# Altium project CATPIR.PrjPcb
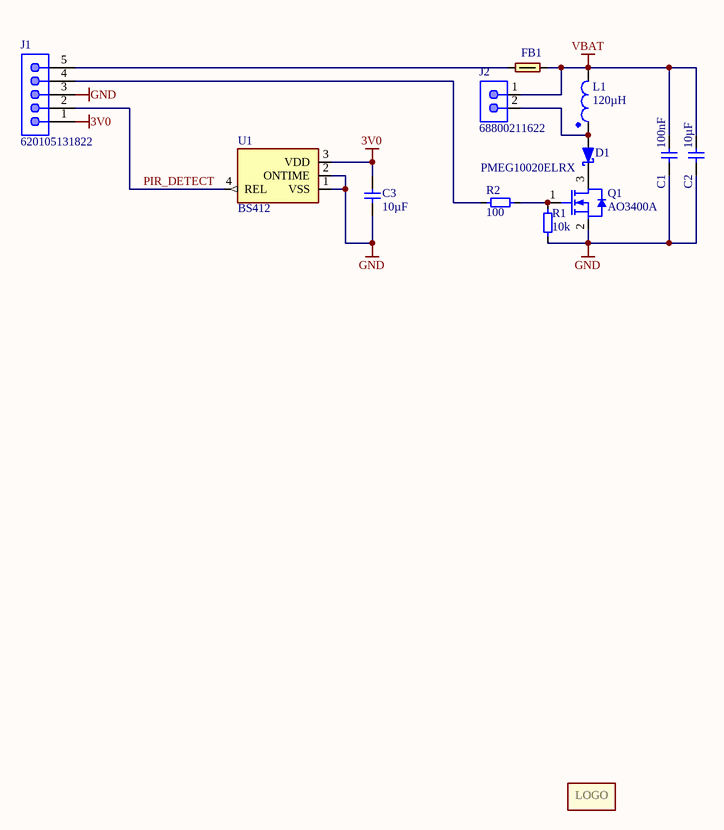
[diagram p0: pir-piezo.SchDoc]
assembly_revision: 0; board_name: CATPIR; board_revision: 1.0; Project_link: https://github.com/lieBtrau/cat-repeller
1 sheet, 13 parts. Net scope: global (net labels, ports and power ports of the same name join across sheets).
Board file: CATPIR.PcbDoc

## Sheet pir-piezo.SchDoc: PIR-sensor & Piezo speaker
size A4; Engineer: CT; SheetNumber: 1; SheetTotal: 1

### Parts
C1  value 100nF  [0603-C-N]  (hidden comment: Capacitor 100nF +/-10% 25V X7R 0603)
C2  value 10µF  [1206-C-N]  (hidden comment: Capacitor 10µF +/-10% 10V X7R 1206)
C3  value 10µF  [1206-C-N]  (hidden comment: Capacitor 10µF +/-10% 10V X7R 1206)
D1  PMEG10020ELRX  [FP-SOD123W-MFG]
FB1  742792625  [0603-L-N]  (value not drawn)
J1  620105131822  [620105131822]
J2  68800211622  [68800211622]
L1  Inductance: 120µH  [CL_STD6060]  (hidden comment: 74404064121)
M1  Logo  [LOGO_9x6mm]  (value not drawn)  (no BOM)
Q1  AO3400A  [SOT-23-3-N]
R1  value 10k  [0603-R-N]  (hidden comment: Resistor 10k +/-1% 50V 0603)
R2  value 100  [0603-R-N]  (hidden comment: Resistor 100R +/-1% 50V 0603)
U1  BS412  [BS412-Footprint-1]

### Nets
3V0: C3.1 J1.1 U1.3(VDD)
GND: C1.2 C2.1 C3.2 J1.3 Q1.2(S) R1.2 U1.1(VSS) U1.2(ONTIME)
VBAT: C1.1 C2.2 FB1.2 J2.1 L1.2
PIR_DETECT: J1.2 U1.4(REL)
NetD1_1: D1.1(K) Q1.3(D)
NetD1_2: D1.2(A) J2.2 L1.1
NetFB1_1: FB1.1 J1.5
NetJ1_4: J1.4 R2.1
NetQ1_1: Q1.1(G) R1.1 R2.2

### Notes on the sheet
- Title
- Sheet Revision:
- Link:
- Size:
- Project:
- Engineer:
- A4
- Date:
- Sheet
- of
- File:
- (in symbol Logo) LOGO

### Library data of the parts
C1 = CMP-072-000592-15: WCAP-CSGP Multilayer Ceramic Chip Capacitor, General Purpose, size 0603, X7R, 100nF, 25VDC; FLIR Part #: YCAM100N-5; Capacitor Type: MLCC; Dissipation Factor: 3.5%; Insulation Resistance: 5GO; Technical Reference: X7R0603104K025DFCT10000; Tolerance: 10%; Case/Package: 0603; ComponentLink1Description: Website Link; ComponentLink1URL: https://www.we-online.com/redexpert/article/885012206071?ad; ComponentLink2Description: Datasheet Link; ComponentLink2URL: https://www.we-online.com/redexpert/spec/885012206071?ad; Design Item ID: 885012206071; Dielectric: X7R; Height: 0.8mm; JLCPCB Part #: C14663; Length: 1.6mm; Match Code: WCAP-CSGP; Max Operating Temperature: 125°C; Min Operating Temperature: -55°C; Mounting Technology: SMT; Packaging: Tape and Reel; Pins: 2; Source: WCAP-CSGP.SchLib; Usage: General Purpose; Voltage Rating: 25V; Width: 0.8mm
C2 C3 = CMP-072-000777-16: WCAP-CSGP Multilayer Ceramic Chip Capacitor, General Purpose, size 1206, X7R, 10µF, 10VDC; FLIR Part #: YCAM10U-9; Capacitor Type: MLCC; Technical Reference: X7R1206106K010DFCT10000; Tolerance: 10%; Insulation Resistance: 0.01GO; JLCPCB Part #: C70462; ComponentLink2Description: Datasheet Link; Voltage Rating: 10V; ComponentLink1URL: https://www.we-online.com/redexpert/article/885012208018?ad; ComponentLink2URL: https://www.we-online.com/redexpert/spec/885012208018?ad; Width: 1.6mm; Length: 3.2mm; Mounting Technology: SMT; Max Operating Temperature: 125°C; Case/Package: 1206; ComponentLink1Description: Website Link; Match Code: WCAP-CSGP; Height: 1.6mm; Design Item ID: 885012208018; Min Operating Temperature: -55°C; Usage: General Purpose; Dissipation Factor: 10%; Dielectric: X7R; Pins: 2; Packaging: Tape and Reel; Source: WCAP-CSGP.SchLib
D1 = CMP-004-00046-6: Diode Schottky 100V 2A 2-Pin SOD-123F T/R; Forward Voltage: 830 mV @ 2 A; Case/Package: SOD-123F; Packaging: Tape and Reel; Max Reverse Voltage (DC): 100V; Mounting Technology: Surface Mount; JLCPCB Part #: C456130; RoHS Compliant: Yes; Average Rectified Current: 2A; Series: -; Forward Current: 2A
FB1 = CMP-066-000112-5: WE-CBF SMT EMI Suppression Ferrite Bead, size 0603, 120O, 2A; Manufacturer: Wurth Elektronik; FLIR Part #: YCOLFB100E-1; Type: High Current; Impedance Max Test Condition: 400MHz; Case/Size Code: 0603; Impedance Max: 180O; DC Resistance Max: 0.05O; Length: 1.6mm; Impedance @100MHz: 120O; Design Item ID: 742792625; Rated Current: 2A; ComponentLink2Description: Datasheet Link; Width: 0.8mm; ComponentLink1URL: https://www.we-online.com/redexpert/article/742792625?ad; Component Type: Standard; Height: 0.8mm; JLCPCB Part #: C114770; Source: WE-CBF.SchLib; Operating Temperature Min: -55°C; Category: Ferrites for PCB Assembly; Operating Temperature Max: 125°C; Mount: Surface Mount; Packaging: Tape and Reel; ComponentLink1Description: Website Link; ComponentLink2URL: https://www.we-online.com/redexpert/spec/742792625?ad; Manufacturer Part Number: 742792625; Match Code: WE-CBF; Pin Count: 2
J1 = CMP-047-000043-5: WR-WTB SMT Male Horizontal Shrouded Header, pitch 2mm, 5p; Contact Resistance: 20mOhm; Rated Current: 2A; Pin Number: 5; Working Voltage: 100VAC; Withstanding Voltage: 800VAC; Mounting Technology: SMT; Component Type: Standard; ComponentLink1URL: http://www.we-online.de; ComponentLink2URL: https://www.we-online.com/catalog/datasheet/620105131822.pdf; Published Date: January 2020; Pin Count: 5; ComponentLink1Description: Manufacturer; Design Item ID: 620105131822; Packaging: Tape and Reel; Source: WR-WTB_2.00mm.SchLib; Gender: Male; Publisher: Wurth Elektronik; Part Number: 620105131822; ComponentLink2Description: Datasheet; Pitch: 2mm; Operating Temperature: -25 to +85degC; Type: Horizontal; JLCPCB Part #: C265104
J2 = CMP-047-000210-5: WR-WTB “J” Type THT Vertical Male Shrouded Header, pitch 2.5mm, 2p; Working Voltage: 250VAC; Withstanding Voltage: 800VAC; Contact Resistance: 20mOhm; Pin Number: 2; Rated Current: 3A; JLCPCB Part #: C160262; ComponentLink2URL: https://www.we-online.com/catalog/datasheet/68800211622.pdf; Published Date: January 2020; Pin Count: 2; Pitch: 2.5mm; ComponentLink1Description: Manufacturer; Type: Vertical; Design Item ID: 68800211622; Part Number: 68800211622; Publisher: Wurth Elektronik; Operating Temperature: -25 to +85degC; ComponentLink1URL: http://www.we-online.de; ComponentLink2Description: Datasheet; Source: WR-WTB_2.50mm.SchLib; Component Type: Standard; Mounting Technology: THT; Packaging: Bag; Gender: Male
L1 = CMP-002-001279-2: WE-LQS SMT Power Inductor, size 6045, 120µH, 0.85A, 0.52O; Manufacturer: Wurth Elektronik; Case/Size Code: 6045; Saturation Current: 1A; Self Resonant Frequency: 5.78MHz; Match Code: WE-LQS; Mount: Surface Mount; Packaging: Tape and Reel; ComponentLink2Description: Datasheet Link; ComponentLink1URL: https://www.we-online.com/redexpert/article/74404064121?ad; Design Item ID: 74404064121; Length: 6mm; Width: 6mm; Height: 4.5mm; Category: Shielded Power Inductors; DC Resistance: 0.52O; Rated Current: 0.85A; ComponentLink1Description: Website Link; Operating Temperature Max: 125°C; Pin Count: 2; Component Type: Standard; Manufacturer Part Number: 74404064121; Operating Temperature Min: -40°C; Source: WE-LQS.SchLib; ComponentLink2URL: https://www.we-online.com/redexpert/spec/74404064121?ad
Q1 = CMP-013-00063-4: Trans MOSFET N-CH 30V 5.7A 3-Pin SOT-23; Rise Time: 8.3ns; Drain-source On Resistance-Max: 25mR; Max Power Dissipation: 1.4W; Number of Elements: 1; Transistor Type: NMOS; Input Capacitance: 630pF; Element Configuration: Single; Rds On Max: 26.5mR; Polarity: N-CHANNEL; Vgs(th) (Max) @ Id: 900mV @ 250µA; Turn-On Delay Time: 8.1ns; Turn-Off Delay Time: 40.1ns; Fall Time: 9.6ns; Id - Continuous Drain Current: 4.2A; Power Dissipation: 780mW; Gate to Source Voltage (Vgs): 8V; Case/Package: TO-236-3; Packaging: Cut Tape; Min Operating Temperature: -55°C; Max Operating Temperature: 150°C; Length: 3mm; Drain to Source Resistance: 25mR; Continuous Drain Current (ID): 5.7A; Reach SVHC Compliant: Yes; Width: 1.4mm; Number of Channels: 1; Mounting Technology: Surface Mount; JLCPCB Part #: C20917; Package Quantity: 3000; Weight: 0.000282oz; Lead Free: Lead Free; Drain to Source Voltage (Vdss): 30V; Series: -; Height: 1.1mm; On-State Resistance: 25mR; Pins: 3; RoHS Compliant: Yes
R1 = CMP-009-00017-25: Chip Resistor, Thick Film, General Purpose, 0603, 100mW, 50V, 10 kOhm, +/-1%; FLIR Part #: YRES10K-1; Tolerance: 1%; Elements: 1; RoHS Compliant: Yes; Mounting Technology: SMT; Pins: 2; Case/Package: 0603; Usage: General Purpose; JLCPCB Part #: C25804; Max Operating Temperature: 155°C; Min Operating Temperature: -55°C; Power Rating: 100mW; Resistor Type: Thick Film; Voltage Rating: 50V
R2 = CMP-009-00232-15: Chip Resistor, Thick Film, General Purpose, 0603, 63mW, 50V, 100 Ohm, +/-1%; Tolerance: 1%; Elements: 1; Temperature Coefficient: 100ppm/°C; Power Rating: 100mW; Case/Package: 0603; Voltage Rating: 50V; Max Operating Temperature: 155°C; RoHS Compliant: Yes; Usage: General Purpose; Min Operating Temperature: -55°C; Pins: 2; Resistor Type: Thick Film; JLCPCB Part #: C22775; Mounting Technology: SMT
U1 = CMP-001-0045-5: Mini Basic PIR Sensor - BS412; JLCPCB Part #: C410378

## Assembly variants
A: all parts fitted